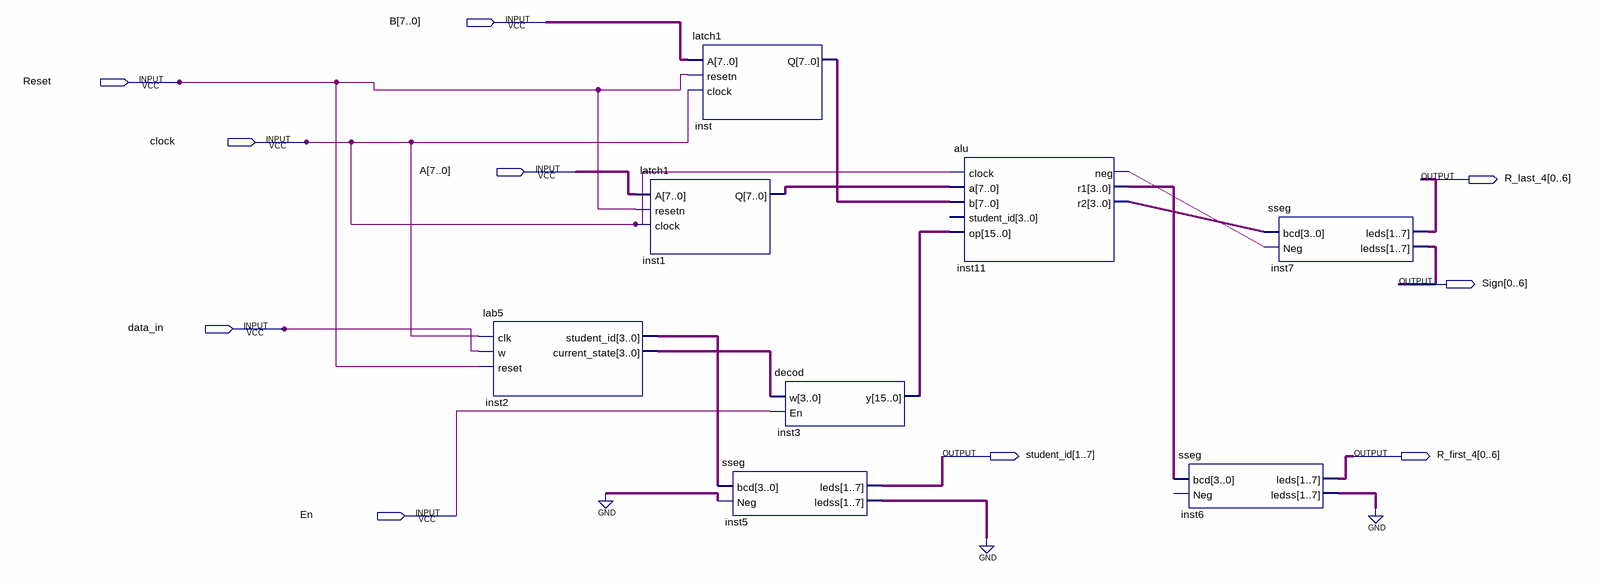
[diagram p0: schematic sheet]
// Quartus schematic gpu.bdf as structural Verilog: 8 symbols, 10 pins
module gpu (
  input  [7:0] B,
  input  Reset,
  input  clock,
  input  [7:0] A,
  input  data_in,
  input  En,
  output [0:6] R_last_4,
  output [0:6] Sign,
  output [1:7] student_id,
  output [0:6] R_first_4
);

  wire inst11_neg;
  wire [3:0] inst2_current_state, inst2_student_id, inst11_r1, inst11_r2;
  wire [6:0] inst5_ledss, inst6_ledss;
  wire [7:0] inst1_q, inst_q;
  wire [15:0] inst3_y;

  lab5 inst2 (
    .clk(clock), .w(data_in), .reset(Reset), .student_id(inst2_student_id),
    .current_state(inst2_current_state));
  latch1 inst (.A(B), .resetn(Reset), .clock(clock), .Q(inst_q));
  latch1 inst1 (.A(A), .resetn(Reset), .clock(clock), .Q(inst1_q));
  sseg inst5 (.bcd(inst2_student_id), .Neg(1'b0), .leds(student_id), .ledss(inst5_ledss));
  decod inst3 (.w(inst2_current_state), .En(En), .y(inst3_y));
  alu inst11 (
    .clock(clock), .a(inst1_q), .b(inst_q), .op(inst3_y), .neg(inst11_neg), .r1(inst11_r1), .r2(inst11_r2));  // open: student_id
  sseg inst6 (.bcd(inst11_r1), .leds(R_first_4), .ledss(inst6_ledss));  // open: Neg
  sseg inst7 (.bcd(inst11_r2), .Neg(inst11_neg), .leds(R_last_4), .ledss(Sign));
  // also tied to GND on the sheet: {inst6_ledss[0], inst6_ledss[1], inst6_ledss[2], inst6_ledss[3], inst6_ledss[4], inst6_ledss[5], inst6_ledss[6], inst5_ledss[0], inst5_ledss[1], inst5_ledss[2], inst5_ledss[3], inst5_ledss[4], inst5_ledss[5], inst5_ledss[6]}
endmodule
